# Altium schematic sheet Peltier.SchDoc: Peltier
size A3; Revision: 1.0; SheetNumber: 8; SheetTotal: 11; Class: B
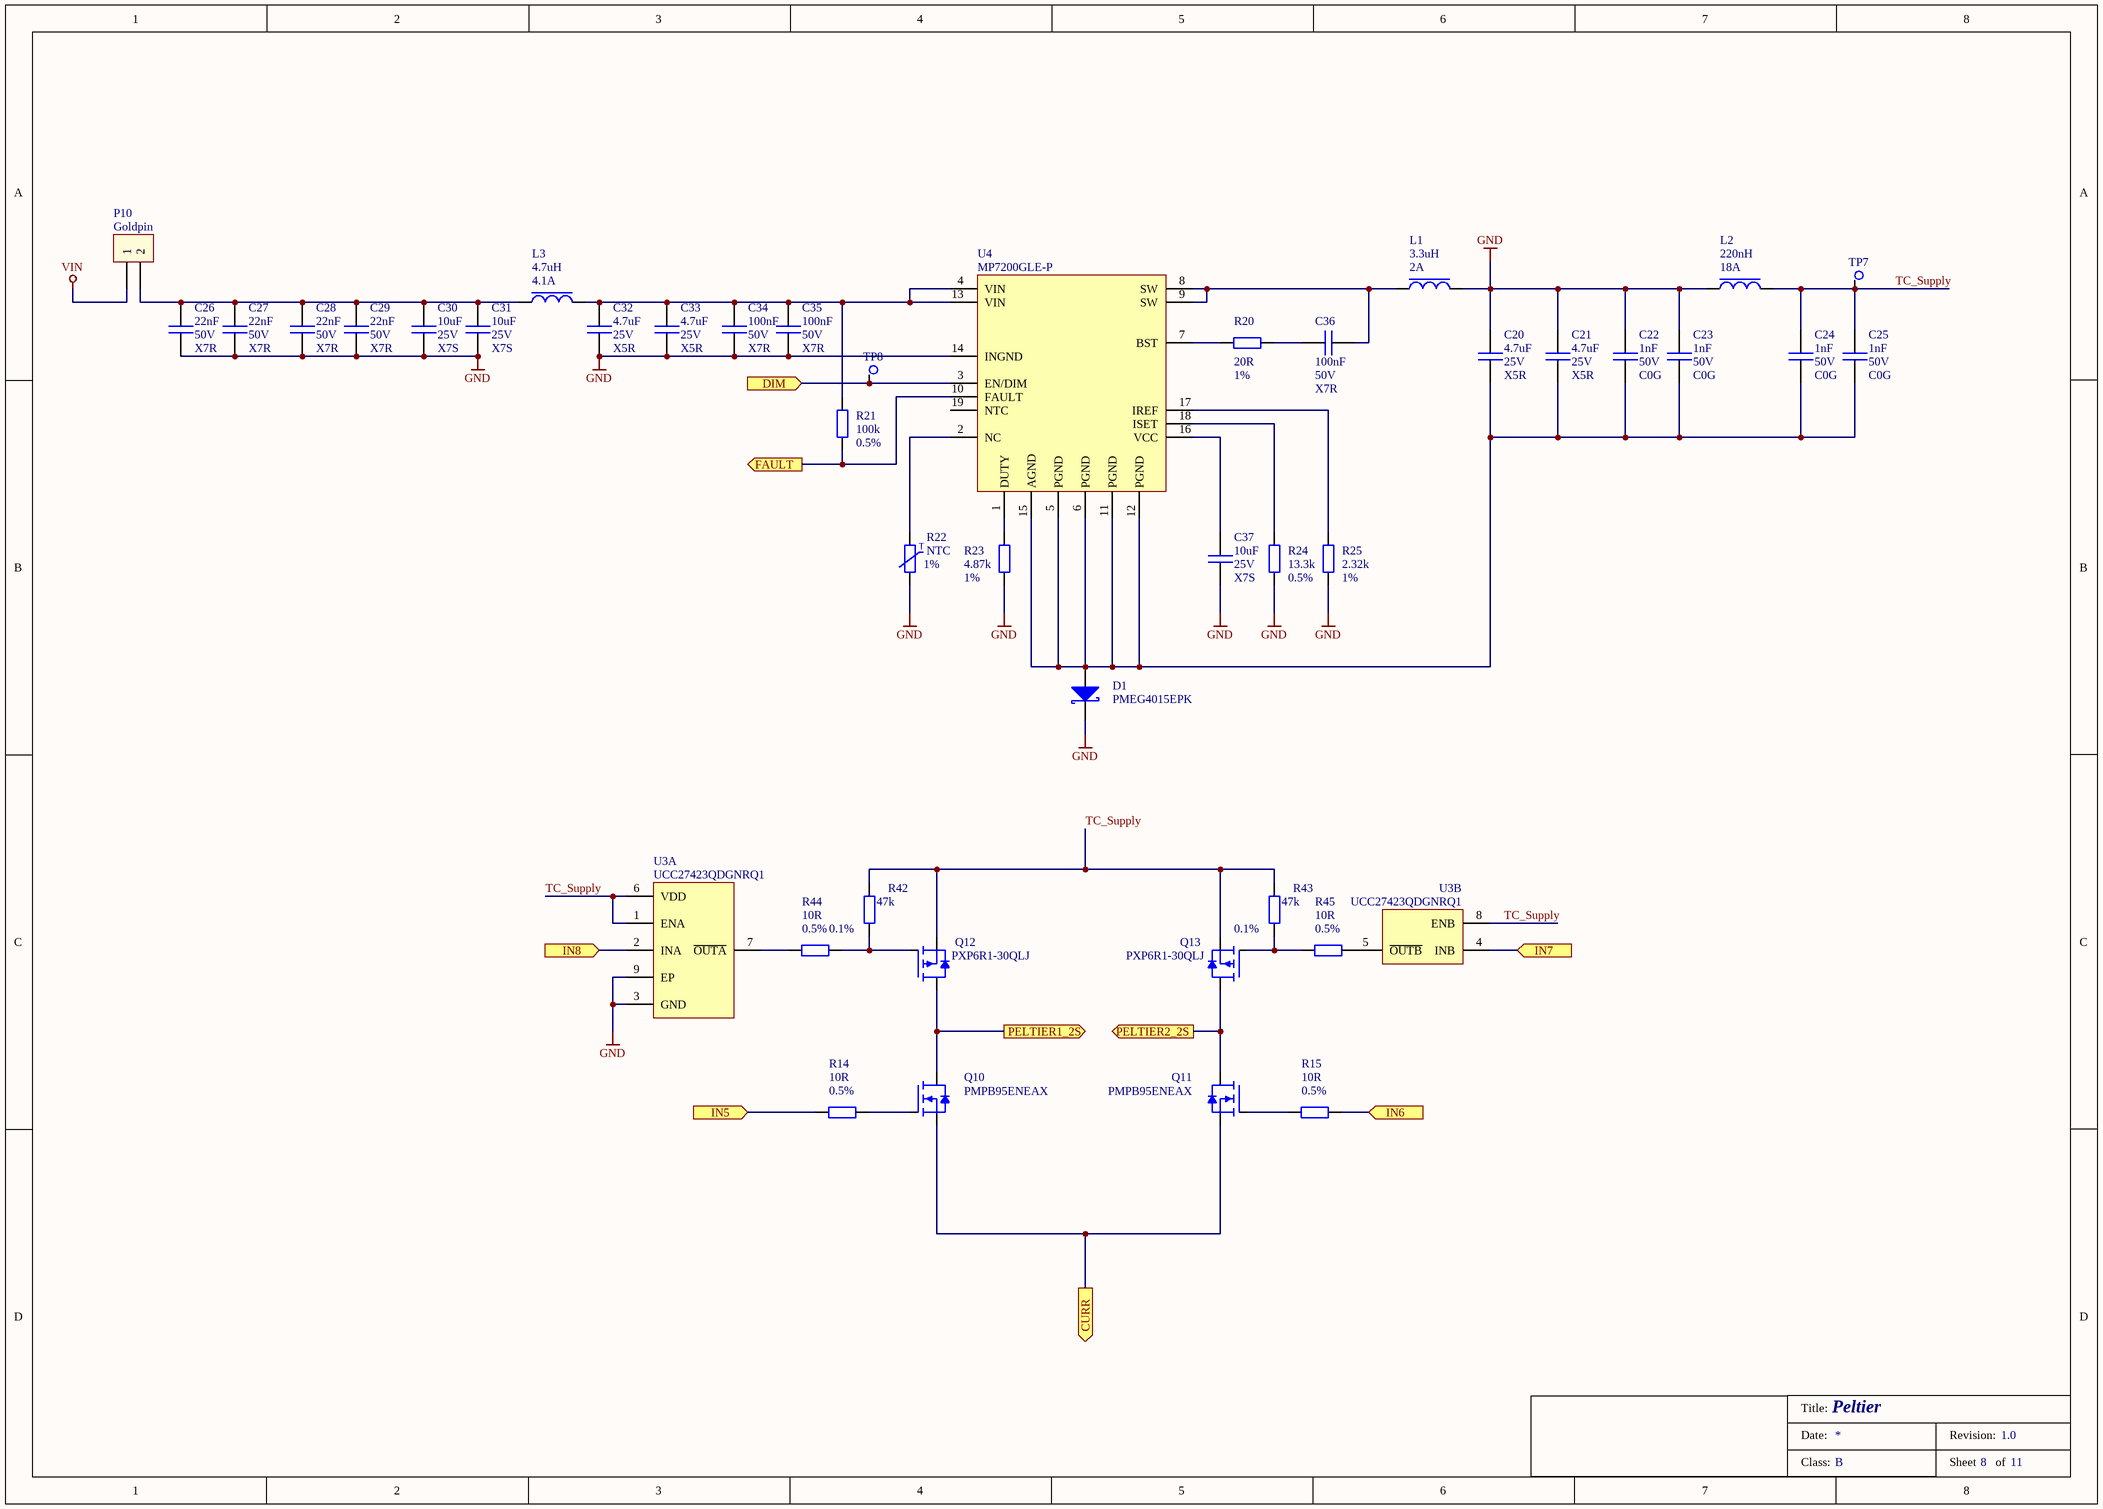
[diagram p0: Peltier.SchDoc]

## Parts
C20  value 4.7uF  Voltage: 25V  Dielectric: X5R  [C_0603]  (hidden comment: C)
C21  value 4.7uF  Voltage: 25V  Dielectric: X5R  [C_0603]  (hidden comment: C)
C22  value 1nF  Voltage: 50V  Dielectric: C0G  [C_0603]  (hidden comment: C)
C23  value 1nF  Voltage: 50V  Dielectric: C0G  [C_0603]  (hidden comment: C)
C24  value 1nF  Voltage: 50V  Dielectric: C0G  [C_0603]  (hidden comment: C)
C25  value 1nF  Voltage: 50V  Dielectric: C0G  [C_0603]  (hidden comment: C)
C26  value 22nF  Voltage: 50V  Dielectric: X7R  [C_0603]  (hidden comment: C)
C27  value 22nF  Voltage: 50V  Dielectric: X7R  [C_0603]  (hidden comment: C)
C28  value 22nF  Voltage: 50V  Dielectric: X7R  [C_0603]  (hidden comment: C)
C29  value 22nF  Voltage: 50V  Dielectric: X7R  [C_0603]  (hidden comment: C)
C30  value 10uF  Voltage: 25V  Dielectric: X7S  [C_0805]  (hidden comment: C)
C31  value 10uF  Voltage: 25V  Dielectric: X7S  [C_0805]  (hidden comment: C)
C32  value 4.7uF  Voltage: 25V  Dielectric: X5R  [C_0603]  (hidden comment: C)
C33  value 4.7uF  Voltage: 25V  Dielectric: X5R  [C_0603]  (hidden comment: C)
C34  value 100nF  Voltage: 50V  Dielectric: X7R  [C_0603]  (hidden comment: C)
C35  value 100nF  Voltage: 50V  Dielectric: X7R  [C_0603]  (hidden comment: C)
C36  value 100nF  Voltage: 50V  Dielectric: X7R  [C_0603]  (hidden comment: C)
C37  value 10uF  Voltage: 25V  Dielectric: X7S  [C_0805]  (hidden comment: C)
D1  value PMEG4015EPK  [D_SOD_1608]  (hidden comment: D_SHOTTKY)
L1  value 3.3uH  Max Current: 2A  [L_1008_05]  (hidden comment: L_Core)
L2  value 220nH  Max Current: 18A  [L_2020]  (hidden comment: L_Core)
L3  value 4.7uH  Max Current: 4.1A  [L_2020]  (hidden comment: L_Core)
P10  P_Header_2  [GOLDPIN_2]  (value not drawn)
Q10  value PMPB95ENEAX  [UDFN_6_3123]  (hidden comment: Q_NMOSFET)
Q11  value PMPB95ENEAX  [UDFN_6_3123]  (hidden comment: Q_NMOSFET)
Q12  value PXP6R1-30QLJ  [WDFN_8]  (hidden comment: Q_PMOSFET)
Q13  value PXP6R1-30QLJ  [WDFN_8]  (hidden comment: Q_PMOSFET)
R14  value 10R  Tolerance: 0.5%  [R_0603]  (hidden comment: R)
R15  value 10R  Tolerance: 0.5%  [R_0603]  (hidden comment: R)
R20  value 20R  Tolerance: 1%  [R_0603]  (hidden comment: R)
R21  value 100k  Tolerance: 0.5%  [R_0402]  (hidden comment: R)
R22  Tolerance: 1%  [R_0402]  (hidden comment: R_B572xxV5)
R23  value 4.87k  Tolerance: 1%  [R_0402]  (hidden comment: R)
R24  value 13.3k  Tolerance: 0.5%  [R_0402]  (hidden comment: R)
R25  value 2.32k  Tolerance: 1%  [R_0402]  (hidden comment: R)
R42  value 47k  Tolerance: 0.1%  [R_0402]  (hidden comment: R)
R43  value 47k  Tolerance: 0.1%  [R_0402]  (hidden comment: R)
R44  value 10R  Tolerance: 0.5%  [R_0603]  (hidden comment: R)
R45  value 10R  Tolerance: 0.5%  [R_0603]  (hidden comment: R)
TP7  TP_TestPoint  [TP_01]  (value not drawn)
TP8  TP_TestPoint  [TP_01]  (value not drawn)
U3  value UCC27423QDGNRQ1  [MSOP_8]  (hidden comment: IC_UCC27423_Q1)  (parts A,B of 2)
U4  =Value: MP7200GLE-P  [QFN_19]  (hidden comment: IC_MP7200)

## Ports
CURR (out), DIM (in), FAULT (out), IN5 (in), IN6 (in), IN7 (in), IN8 (in), PELTIER1_2S (out), PELTIER2_2S (out)

## Nets
GND: C20.1 C21.1 C22.1 C23.1 C26.2 C27.2 C28.2 C29.2 C30.2 C31.2 C32.2 C33.2 C34.2 C35.2 C37.2 D1.2(K) L1.2 L2.1 R22.2 R23.2 R24.2 R25.2 U3.3(GND) U3.9(EP) U4.14(INGND)
VIN: P10.1
CURR: Q10.2(S) Q11.2(S) ; port CURR
DIM: TP8.1 U4.3(EN/DIM) ; port DIM
FAULT: R21.2 U4.10(FAULT) ; port FAULT
IN5: R14.1 ; port IN5
IN6: R15.2 ; port IN6
IN7: U3.4(INB) ; port IN7
IN8: U3.2(INA) ; port IN8
PELTIER1_2S: Q10.3(D) Q12.3(D) ; port PELTIER1_2S
PELTIER2_2S: Q11.3(D) Q13.3(D) ; port PELTIER2_2S
TC_Supply: C24.1 C25.1 L2.2 Q12.2(S) Q13.2(S) R42.1 R43.1 TP7.1 U3.1(ENA) U3.6(VDD) U3.8(ENB)
NetC20_2: C20.2 C21.2 C22.2 C23.2 C24.2 C25.2 D1.1(A) U4.5(PGND) U4.6(PGND) U4.11(PGND) U4.12(PGND) U4.15(AGND)
NetC26_1: C26.1 C27.1 C28.1 C29.1 C30.1 C31.1 L3.1 P10.2
NetC32_1: C32.1 C33.1 C34.1 C35.1 L3.2 R21.1 U4.4(VIN) U4.13(VIN)
NetC36_1: C36.1 R20.2
NetC36_2: C36.2 L1.1 U4.8(SW) U4.9(SW)
NetC37_1: C37.1 U4.16(VCC)
NetQ10_1: Q10.1(G) R14.2
NetQ11_1: Q11.1(G) R15.1
NetQ12_1: Q12.1(G) R42.2 R44.2
NetQ13_1: Q13.1(G) R43.2 R45.1
NetR20_1: R20.1 U4.7(BST)
NetR22_1: R22.1 U4.2(NC)
NetR23_1: R23.1 U4.1(DUTY)
NetR24_1: R24.1 U4.18(ISET)
NetR25_1: R25.1 U4.17(IREF)
NetR44_1: R44.1 U3.7(~{OUTA})
NetR45_2: R45.2 U3.5(~{OUTB})

Not connected (* = marked no-connect by the designer): U4 19(NTC)

## Notes on the sheet
- Title:
- Date:
- Revision:
- Class:
- Sheet
- of
- (in symbol B57232V5103F360) T

## Library data of the parts
C20 C21 C32 C33 = C_4.7uF_25V_0603: Capacitor; Manufacturer: TDK; Manufacturer Part Number: C1608X5R1E475K080AC; Tmax: 85; Tmin: -55; Grade: 3; Fail Rate: A; Tolerance: 10%; Part Number: C_4.7uF_25V_0603; HelpURL: https://product.tdk.com/system/files/dam/doc/product/capacitor/ceramic/mlcc/catalog/mlcc_commercial_general_en.pdf; Supplier 1: Mouser; Supplier Part Number 1: 810-C1608X5R1E475K; Status: Active
C22-C25 = C_1nF_50V_0603: Capacitor; Manufacturer: Kemet; Manufacturer Part Number: C0603T102J5GAC7867; Tmax: 125; Tmin: -55; Grade: 2; Fail Rate: A; Tolerance: 5%; Part Number: C_1nF_50V_0603; HelpURL: https://content.kemet.com/datasheets/KEM_C1026_C0G_COTS_SMD.pdf; Supplier 1: Digi-Key; Supplier Part Number 1: 399-20423-1-ND; Status: Active
C26-C29 = C_22nF_50V_0603: Capacitor; Manufacturer: Kemet; Manufacturer Part Number: C0603T223K5RAC7867; Tmax: 125; Tmin: -55; Grade: 2; Fail Rate: A; Tolerance: 10%; Part Number: C_22nF_50V_0603; HelpURL: https://content.kemet.com/datasheets/KEM_C1027_X7R_COTS_SMD.pdf; Supplier 1: Digi-Key; Supplier Part Number 1: 399-20429-1-ND; Status: Active
C30 C31 C37 = C_10uF_25V_0805: Capacitor; Manufacturer: TDK; Manufacturer Part Number: CGA4J1X7S1E106K125AC; Tmax: 125; Tmin: -55; Grade: 2; Fail Rate: A; Tolerance: 10%; Part Number: C_10uF_25V_0805; HelpURL: https://product.tdk.com/system/files/dam/doc/product/capacitor/ceramic/mlcc/catalog/mlcc_automotive_general_en.pdf; Supplier 1: Mouser; Supplier Part Number 1: 810-CGA4J1X7S1E106K1; Status: Active
C34-C36 = C_100nF_50V_0603: Capacitor; Manufacturer: Kemet; Manufacturer Part Number: C0603T104K5RCL7136; Tmax: 125; Tmin: -55; Grade: 2; Fail Rate: A; Tolerance: 10%; Part Number: C_100nF_50V_0603; HelpURL: https://content.kemet.com/datasheets/KEM_C1027_X7R_COTS_SMD.pdf; Supplier 1: Digi-Key; Supplier Part Number 1: 399-6305-1-ND; Status: Active
D1 = PMEG4015EPK: 40 V, 1.5 A low VF MEGA Schottky barrier rectifier; Manufacturer: Nexperia; Reverse voltage: 40V; Forward current: 1.5A; Tmax: 150; Tmin: -55; Grade: 2; Part Number: PMEG4015EPK; HelpURL: https://assets.nexperia.com/documents/data-sheet/PMEG4015EPK.pdf; Manufacturer Part Number: PMEG4015EPK; Supplier 1: Mouser; Supplier Part Number 1: 771-PMEG4015EPK,315; Status: Active
L1 = TFM252012ALVA3R3MTAA: Shielded, soft-termination; Manufacturer: TDK; ESR: 140mR; Tmax: 150; Tmin: -55; Grade: 2; Tolerance: 20%; Part Number: TFM252012ALVA3R3MTAA; HelpURL: https://product.tdk.com/en/system/files?file=dam/doc/product/inductor/inductor/smd/catalog/inductor_automotive_power_tfm252012alva_en.pdf; Manufacturer Part Number: TFM252012ALVA3R3MTAA; Supplier 1: Mouser; Supplier Part Number 1: 810-TFM252012ALVA3R3; Status: Active
L2 = IHLP2020CZERR22M8A: Shielded Inductors, High Temperature; Manufacturer: Vishay; ESR: 4.23mR; Tmax: 180; Tmin: -55; Grade: 2; Tolerance: 20%; Part Number: IHLP2020CZERR22M8A; HelpURL: https://www.mouser.pl/datasheet/2/427/ihlp_2020cz_8a-2898337.pdf; Manufacturer Part Number: IHLP2020CZERR22M8A; Supplier 1: Mouser; Supplier Part Number 1: 70-IHLP2020CZRR22M8A; Status: Active
L3 = IHLP2020CZER4R7M5A: Shielded automotive Inductors, High Temperature; Manufacturer: Vishay; Manufacturer Part Number: IHLP2020CZER4R7M5A / IHLP2020CZER4R7M5A; ESR: 78.3mR; Tmax: 155; Tmin: -55; Grade: 2; Tolerance: 20%; Part Number: IHLP2020CZER4R7M5A; HelpURL: https://www.vishay.com/docs/34384/lp20cz5a.pdf; Supplier 2: Digi-Key; Supplier Part Number 2: 541-IHLP2020CZER4R7M5ACT-ND; Supplier 1: Mouser; Supplier Part Number 1: 70-IHLP2020CZR4R7M5A; Status: Active
P10 = 77311-818-02LF: Goldpin; Manufacturer: AMPHENOL; Grade: 3; Value: 77311-818-02LF; Desc: Goldpin; Part Number: 77311-818-02LF; HelpURL: https://cdn.amphenol-icc.com/media/wysiwyg/files/documentation/datasheet/boardwiretoboard/bwb_bergstik.pdf; Manufacturer Part Number: 77311-818-02LF; Supplier 1: TME; Supplier Part Number 1: 77311-818-02LF; Status: Active
Q10 Q11 = PMPB95ENEAX: Single N-channel Trench MOSFET; Manufacturer: NEXPERIA; Max Power Dissipation: 1.6W; Tmax: 150; Tmin: -55; Grade: 2; Part Number: PMPB95ENEAX; HelpURL: https://assets.nexperia.com/documents/data-sheet/PMPB95ENEA.pdf; Manufacturer Part Number: PMPB95ENEAX; Supplier 1: Mouser; Supplier Part Number 1: 771-PMPB95ENEAX; Status: Active
Q12 Q13 = PXP6R1-30QLJ: Low Vgs Single P-Channel; Manufacturer: NEXPERIA; Max Power Dissipation: 50W; Tmax: 150; Tmin: -55; Grade: 2; Part Number: PXP6R1-30QLJ; HelpURL: https://assets.nexperia.com/documents/data-sheet/PXP6R1-30QL.pdf; Manufacturer Part Number: PXP6R1-30QLJ; Supplier 1: Mouser; Supplier Part Number 1: 771-PXP6R1-30QLJ; Status: Active
R14 R15 R44 R45 = R_10R_75V_0603: Manufacturer: Vishay; Manufacturer Part Number: MCT0603PD1009DP500; Voltage: 75V; RMS Power: 0.25W; TCR: 25ppm; Tmax: 175; Tmin: -55; Grade: 2; Part Number: R_10R_75V_0603; HelpURL: https://www.vishay.com/docs/28916/mcxhp.pdf; Supplier 2: Mouser; Supplier Part Number 2: 594-MCT0603PD1009DP5; Supplier 1: Digi-Key; Supplier Part Number 1: 749-1520-1-ND; Status: Active
R20 = R_20R_75V_0603: Manufacturer: Panasonic; Manufacturer Part Number: ERJ-H3EF20R0V; Voltage: 75V; RMS Power: 0.125W; TCR: 100ppm; Tmax: 175; Tmin: -55; Grade: 2; Part Number: R_20R_75V_0603; HelpURL: https://industrial.panasonic.com/cdbs/www-data/pdf/RDQ0000/ast-ind-151033.pdf; Supplier 1: Mouser; Supplier Part Number 1: 667-ERJ-H3EF20R0V; Status: Active
R21 = R_100k_50V_0402: Manufacturer: Vishay; Manufacturer Part Number: MCS0402PD1003DE500; Voltage: 50V; RMS Power: 0.2W; TCR: 25ppm; Tmax: 175; Tmin: -55; Grade: 2; Part Number: R_100k_50V_0402; HelpURL: https://www.vishay.com/docs/28916/mcxhp.pdf; Supplier 2: Mouser; Supplier Part Number 2: 594-MCS0402PD1003DP5; Supplier 1: Digi-Key; Supplier Part Number 1: 749-1519-1-ND; Status: Active
R22 = B57232V5103F360: NTC; Manufacturer: TDK; Resistance: 10k; Tmax: 150; Tmin: -40; Grade: 2; Desc: NTC; Value: B57232V5103F360; Part Number: B57232V5103F360; HelpURL: https://product.tdk.com/info/en/documents/data_sheet/50/db/ntc/NTC_SMD_Automotive_series_0402.pdf; Manufacturer Part Number: B57232V5103F360; Supplier 1: Mouser; Supplier Part Number 1: 871-B57232V5103F360; Status: Active
R23 = R_4.87k_50V_0402: Manufacturer: Panasonic; Manufacturer Part Number: ERJ-2RKF4871X; Voltage: 50V; RMS Power: 0.1W; TCR: 100ppm; Tmax: 155; Tmin: -55; Grade: 2; Part Number: R_4.87k_50V_0402; HelpURL: https://industrial.panasonic.com/cdbs/www-data/pdf/RDA0000/AOA0000C304.pdf; Supplier 1: Mouser; Supplier Part Number 1: 667-ERJ-2RKF4871X; Status: Active
R24 = R_13.3k_50V_0402: Manufacturer: Panasonic; Manufacturer Part Number: ERJ-U02D1332X; Voltage: 50V; RMS Power: 0.1W; TCR: 200ppm; Tmax: 155; Tmin: -55; Grade: 2; Part Number: R_13.3k_50V_0402; HelpURL: https://industrial.panasonic.com/cdbs/www-data/pdf/RDP0000/AOA0000C334.pdf; Supplier 1: Mouser; Supplier Part Number 1: 667-ERJ-U02D1332X; Status: Active
R25 = R_2.32k_50V_0402: Manufacturer: Panasonic; Manufacturer Part Number: ERJ-2RKF2321X; Voltage: 50V; RMS Power: 0.1W; TCR: 100ppm; Tmax: 155; Tmin: -55; Grade: 2; Part Number: R_2.32k_50V_0402; HelpURL: https://industrial.panasonic.com/cdbs/www-data/pdf/RDA0000/AOA0000C304.pdf; Supplier 1: Mouser; Supplier Part Number 1: 667-ERJ-2RKF2321X; Status: Active
R42 R43 = R_47k_50V_0402: Manufacturer: Vishay; Manufacturer Part Number: MCS0402MD4702BE100; Voltage: 50V; RMS Power: 0.1W; TCR: 25ppm; Tmax: 155; Tmin: -55; Grade: 2; Part Number: R_47k_50V_0402; HelpURL: https://www.vishay.com/docs/28785/mcat_pre.pdf; Supplier 2: Mouser; Supplier Part Number 2: 594-MCS0402MD4702BE1; Supplier 1: Digi-Key; Supplier Part Number 1: MCS0402-47.0K-MBCT-ND; Status: Active
TP7 TP8 = TestPoint1: Manufacturer: Progresja Space; Value: TP; Grade: 3; Part Number: TestPoint1; Status: Active
U3 = UCC27423: Dual 4-A High-Speed Low-Side MOSFET Drivers With Enable; Manufacturer: TI; Tmax: 125; Tmin: -40; Grade: 2; Part Number: UCC27423; HelpURL: https://www.ti.com/lit/ds/symlink/ucc27423-q1.pdf?HQS=dis-mous-null-mousermode-dsf-pf-null-wwe&ts=1651498832882&ref_url=https%253A%252F%252Fwww.mouser.pl%252F; Manufacturer Part Number: UCC27423QDGNRQ1; Supplier 1: Mouser; Supplier Part Number 1: 595-UCC27423QDGNRQ1; Status: Active
U4 = MP7200GLE-P: Continous current Buck-Boost DC-DC Converter; Manufacturer: MPS; Tmax: 125; Tmin: -40; Grade: 2; Part Number: MP7200GLE-P; Value: MP7200GLE-P; HelpURL: https://www.monolithicpower.com/en/documentview/productdocument/index/version/2/document_type/Datasheet/lang/en/sku/MP7200GLE/document_id/9789/; Manufacturer Part Number: MP7200GLE-P; Supplier 2: Mouser; Supplier Part Number 2: 946-MP7200GLE-P; Status: Active